# EAGLE schematic Control board FINAL (EAGLE 6.2)

## Sheet 1 of 4
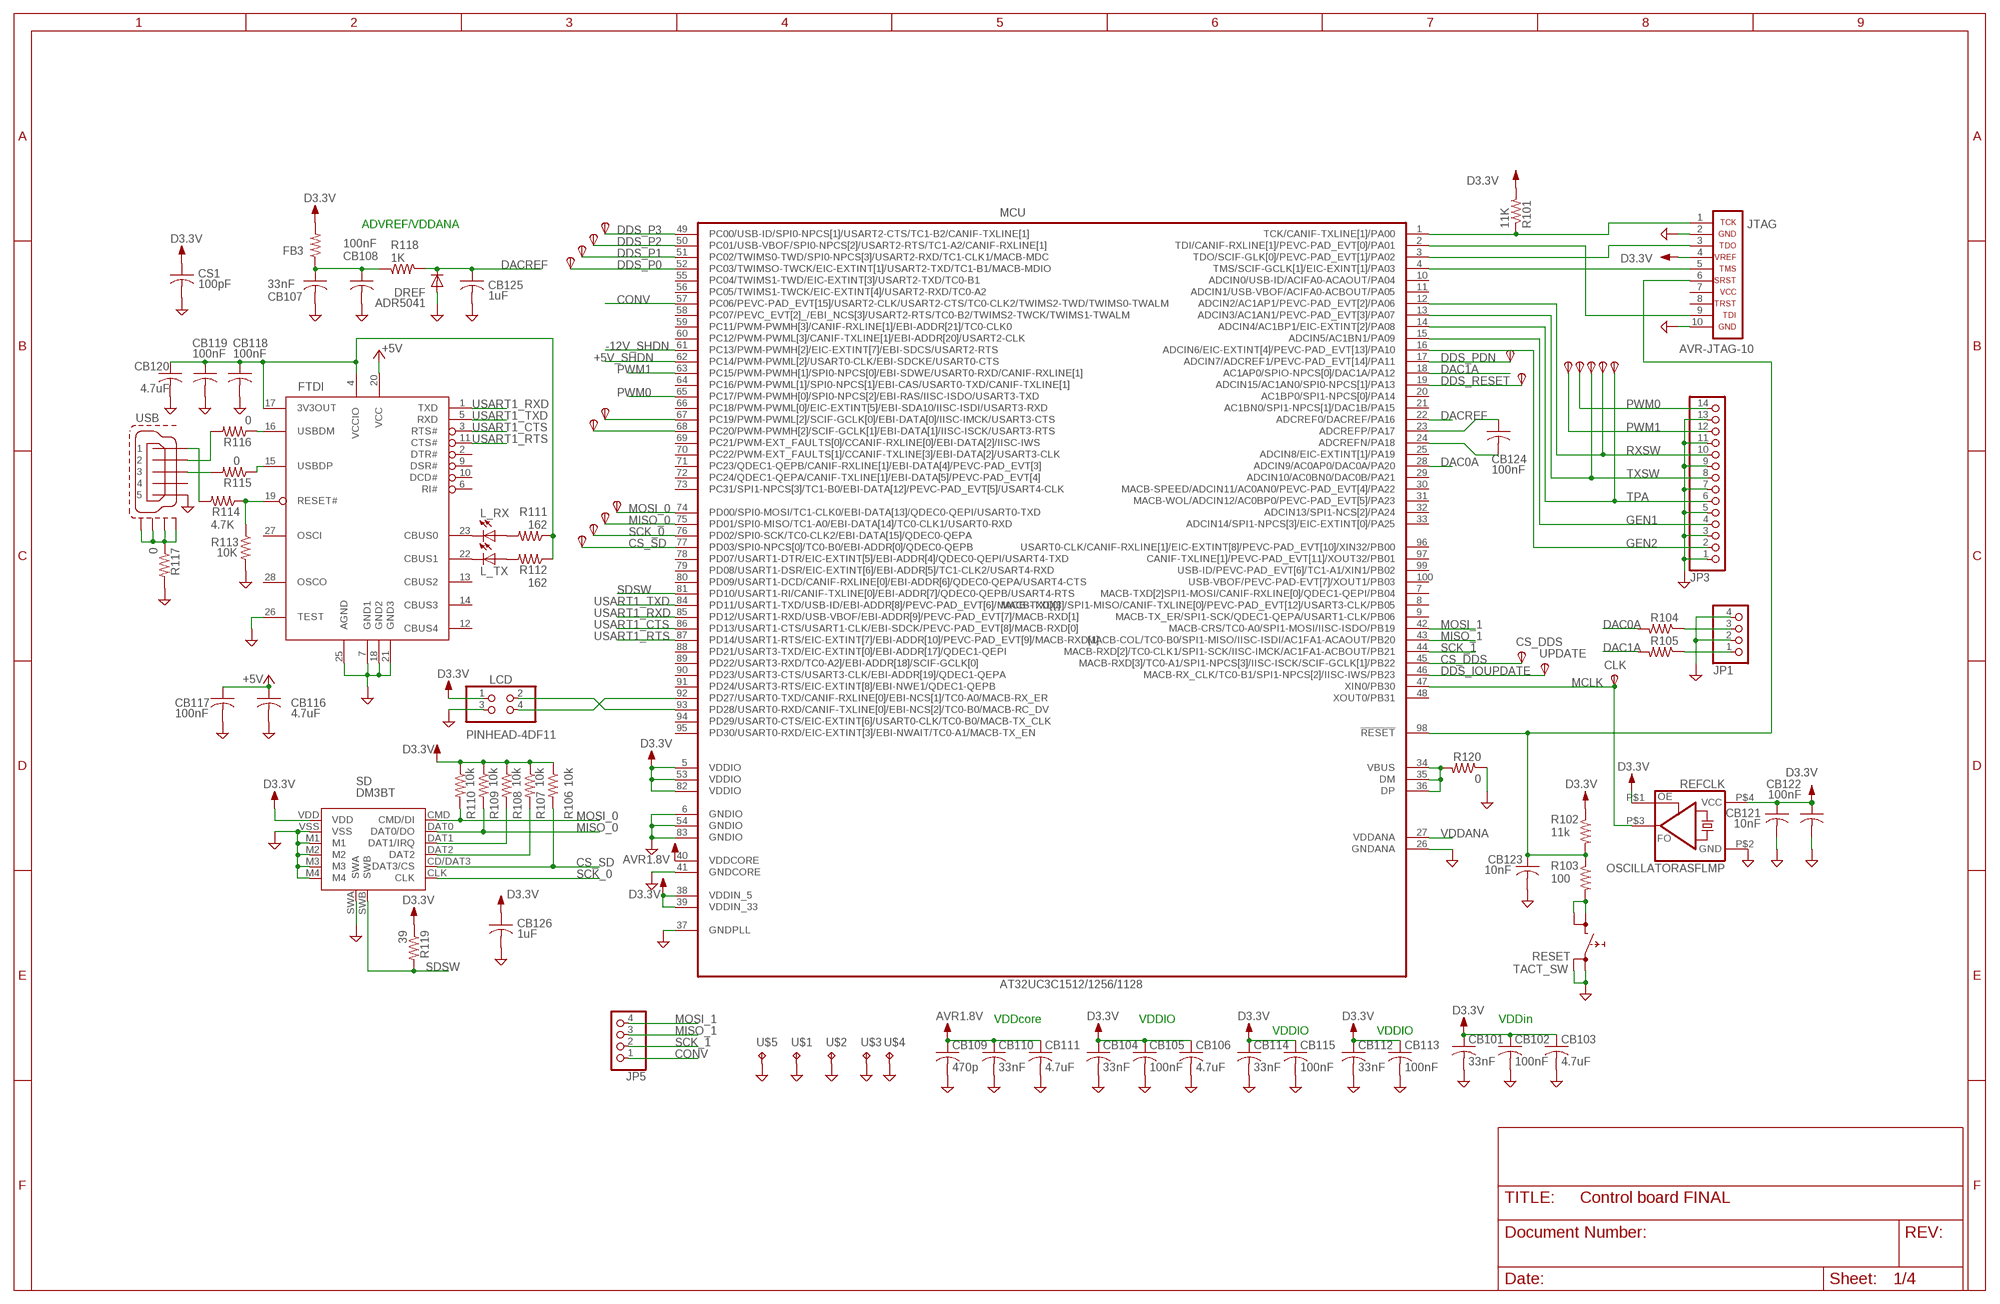
[diagram p0: schematic, sheet 1]

### Parts
CB101  33nF  C-USC0603  [C0603]
CB102  100nF  C-USC0603  [C0603]
CB103  4.7uF  C-USC0805  [C0805]
CB104  33nF  C-USC0603  [C0603]
CB105  100nF  C-USC0603  [C0603]
CB106  4.7uF  C-USC0805  [C0805]
CB107  33nF  C-USC0603  [C0603]
CB108  100nF  C-USC0603  [C0603]
CB109  470p  C-USC0603  [C0603]
CB110  33nF  C-USC0603  [C0603]
CB111  4.7uF  C-USC0805  [C0805]
CB112  33nF  C-USC0603  [C0603]
CB113  100nF  C-USC0603  [C0603]
CB114  33nF  C-USC0603  [C0603]
CB115  100nF  C-USC0603  [C0603]
CB116  4.7uF  C-USC0805  [C0805]
CB117  100nF  C-USC0603  [C0603]
CB118  100nF  C-USC0603  [C0603]
CB119  100nF  C-USC0603  [C0603]
CB120  4.7uF  C-USC0805  [C0805]
CB121  10nF  C-USC0603  [C0603]
CB122  100nF  C-USC0603  [C0603]
CB123  10nF  C-USC0603  [C0603]
CB124  100nF  C-USC0603  [C0603]
CB125  1uF  C-USC0603  [C0603]
CB126  1uF  C-USC0603  [C0603]
CLK  TPSTP10R  [TP10R]
CS1  100pF  C-USC0805  [C0805]
CS_DDS  TPSTP10R  [TP10R]
CS_SD  TPSTP10R  [TP10R]
DDSPDN  TPSTP10R  [TP10R]
DDSRESET  TPSTP10R  [TP10R]
DREF  ADR5041  REFERENCE-ADR50XXSOT23-3  [SOT23-3]
FB3  R-US_R0603  [R0603]
FTDI  FT232RL  [SSOP28DB]
GCLK0  TPSTP10R  [TP10R]
GCLK1  TPSTP10R  [TP10R]
JP1  PINHD-1X4  [1X04]
JP3  PINHD-1X14  [1X14]
JP5  PINHD-1X4  [1X04]
JTAG  AVR-JTAG-10  [AVR-JTAG-10]
L_RX  LEDCHIPLED_0805  [CHIPLED_0805]
L_TX  LEDCHIPLED_0805  [CHIPLED_0805]
LCD  PINHEAD-4DF11  [DF11-4POS]
MCU  AT32UC3C1512/1256/1128  [TQFP100]
MISO0  TPSTP10R  [TP10R]
MOSI0  TPSTP10R  [TP10R]
P0  TPSTP10R  [TP10R]
P1  TPSTP10R  [TP10R]
P2  TPSTP10R  [TP10R]
P3  TPSTP10R  [TP10R]
R101  11K  R-US_R0805  [R0805]
R102  11k  R-US_R0805  [R0805]
R103  100  R-US_R0805  [R0805]
R104  R-US_R0805  [R0805]
R105  R-US_R0805  [R0805]
R106  10k  R-US_R0805  [R0805]
R107  10k  R-US_R0805  [R0805]
R108  10k  R-US_R0805  [R0805]
R109  10k  R-US_R0805  [R0805]
R110  10k  R-US_R0805  [R0805]
R111  162  R-US_R0805  [R0805]
R112  162  R-US_R0805  [R0805]
R113  10K  R-US_R0805  [R0805]
R114  4.7K  R-US_R0805  [R0805]
R115  0  R-US_R0805  [R0805]
R116  0  R-US_R0805  [R0805]
R117  0  R-US_R0805  [R0805]
R118  1K  R-US_R0805  [R0805]
R119  39  R-US_R0805  [R0805]
R120  0  R-US_R0805  [R0805]
REFCLK  OSCILLATORASFLMP  [QFN4_ASFLMP_OSCILLATOR]
RESET  TACT_SW  [KMR2_TACT_SWITCH]
SCK0  TPSTP10R  [TP10R]
SD  DM3BT  [DM3BT]
TP1  TPSTP10R  [TP10R]
TP2  TPSTP10R  [TP10R]
TP3  TPSTP10R  [TP10R]
TP4  TPSTP10R  [TP10R]
TP5  TPSTP10R  [TP10R]
U$1  TESTPOINTKEYSTONE_ELECTRONICS_5016  [SMD_TESTPAD]
U$2  TESTPOINTKEYSTONE_ELECTRONICS_5016  [SMD_TESTPAD]
U$3  TESTPOINTKEYSTONE_ELECTRONICS_5016  [SMD_TESTPAD]
U$4  TESTPOINTKEYSTONE_ELECTRONICS_5016  [SMD_TESTPAD]
U$5  TESTPOINTKEYSTONE_ELECTRONICS_5016  [SMD_TESTPAD]
UPDATE  TPSTP10R  [TP10R]
USB  MINI-USB-SHIELD-UX60A-MB-5ST  [UX60A-MB-5ST]

### Nets
+5V: CB116.1 CB117.1 FTDI.20(VCC) ; also sheet 2,4
+5V_SHDN: MCU.62(PC14/PWM-PWML[2]/USART0-CLK/EBI-SDCKE/USART0-CTS) ; also sheet 4
-12V_SHDN: MCU.61(PC13/PWM-PWMH[2]/EIC-EXTINT[7]/EBI-SDCS/USART2-RTS) ; also sheet 4
AVR1.8V: CB109.1 CB110.1 CB111.1 MCU.40(VDDCORE)
CONV: JP5.1 MCU.57(PC06/PEVC-PAD_EVT[15]/USART2-CLK/USART2-CTS/TC0-CLK2/TWIMS2-TWD/TWIMS0-TWALM) ; also sheet 3
CS_DDS [Lowspeed digital]: CS_DDS.TP(PP) MCU.45(MACB-RXD[3]/TC0-A1/SPI1-NPCS[3]/IISC-ISCK/SCIF-GCLK[1]/PB22) ; also sheet 2
CS_SD: CS_SD.TP(PP) MCU.77(PD03/SPI0-NPCS[0]/TC0-B0/EBI-ADDR[0]/QDEC0-QEPB) R106.2 SD.CD/DAT3(DAT3/CS)
D3.3V: CB101.1 CB102.1 CB103.1 CB104.1 CB105.1 CB106.1 CB112.1 CB113.1 CB114.1 CB115.1 CB121.1 CB122.1 CB126.1 CS1.1 FB3.2 JTAG.4 LCD.1 MCU.5(VDDIO) MCU.38(VDDIN_5) MCU.39(VDDIN_33) MCU.53(VDDIO) MCU.82(VDDIO) R101.2 R102.1 R106.1 R107.1 R108.1 R109.1 R110.1 R119.1 REFCLK.P$1(OE) REFCLK.P$4(VCC) SD.VDD ; also sheet 2,4
DAC0A: MCU.28(ADCIN9/AC0AP0/DAC0A/PA20) R104.2
DAC1A: MCU.18(AC1AP0/SPIO-NPCS[0]/DAC1A/PA12) R105.2
DACREF: CB125.1 DREF.1(C) MCU.22(ADCREF0/DACREF/PA16) R118.2
DDS_IOUPDATE: MCU.46(MACB-RX_CLK/TC0-B1/SPI1-NPCS[2]/IISC-IWS/PB23) UPDATE.TP(PP) ; also sheet 2
DDS_P0: MCU.52(PC03/TWIMSO-TWCK/EIC-EXTINT[1]/USART2-TXD/TC1-B1/MACB-MDIO) P0.TP(PP) ; also sheet 2
DDS_P1: MCU.51(PC02/TWIMS0-TWD/SPI0-NPCS[3]/USART2-RXD/TC1-CLK1/MACB-MDC) P1.TP(PP) ; also sheet 2
DDS_P2 [Lowspeed digital]: MCU.50(PC01/USB-VBOF/SPI0-NPCS[2]/USART2-RTS/TC1-A2/CANIF-RXLINE[1]) P2.TP(PP) ; also sheet 2
DDS_P3 [Lowspeed digital]: MCU.49(PC00/USB-ID/SPI0-NPCS[1]/USART2-CTS/TC1-B2/CANIF-TXLINE[1]) P3.TP(PP) ; also sheet 2
DDS_PDN: DDSPDN.TP(PP) MCU.17(ADCIN7/ADCREF1/PEVC-PAD_EVT[14]/PA11) ; also sheet 2
DDS_RESET: DDSRESET.TP(PP) MCU.19(ADCIN15/AC1AN0/SPI0-NPCS[1]/PA13) ; also sheet 2
DGND: USB.5
GEN1: JP3.4 MCU.15(ADCIN5/AC1BN1/PA09)
GEN2: JP3.2 MCU.16(ADCIN6/EIC-EXTINT[4]/PEVC-PAD_EVT[13]/PA10)
GND: CB101.2 CB102.2 CB103.2 CB104.2 CB105.2 CB106.2 CB107.2 CB108.2 CB109.2 CB110.2 CB111.2 CB112.2 CB113.2 CB114.2 CB115.2 CB116.2 CB117.2 CB118.2 CB119.2 CB120.2 CB121.2 CB122.2 CB123.2 CB125.2 CB126.2 CS1.2 DREF.2(A) FTDI.7(GND1) FTDI.18(GND2) FTDI.21(GND3) FTDI.25(AGND) FTDI.26(TEST) JP1.2 JP1.4 JP3.1 JP3.3 JP3.5 JP3.7 JP3.9 JP3.11 JP3.13 JTAG.2 JTAG.10 LCD.3 MCU.6(GNDIO) MCU.26(GNDANA) MCU.37(GNDPLL) MCU.41(GNDCORE) MCU.54(GNDIO) MCU.83(GNDIO) R113.2 R117.2 R120.1 REFCLK.P$2(GND) RESET.P$1 RESET.P$3 SD.M1 SD.M2 SD.M3 SD.M4 SD.SWA SD.VSS U$1.P$1(TP) U$2.P$1(TP) U$3.P$1(TP) U$4.P$1(TP) U$5.P$1(TP) ; also sheet 2,3,4
MCLK: CLK.TP(PP) MCU.47(XIN0/PB30) REFCLK.P$3(FO) ; also sheet 2
MISO_0: MCU.75(PD01/SPI0-MISO/TC1-A0/EBI-DATA[14]/TC0-CLK1/USART0-RXD) MISO0.TP(PP) R109.2 SD.DAT0(DAT0/DO)
MISO_1: JP5.3 MCU.43(MACB-COL/TC0-B0/SPI1-MISO/IISC-ISDI/AC1FA1-ACAOUT/PB20) ; also sheet 2,3
MOSI_0: MCU.74(PD00/SPI0-MOSI/TC1-CLK0/EBI-DATA[13]/QDEC0-QEPI/USART0-TXD) MOSI0.TP(PP) R110.2 SD.CMD(CMD/DI)
MOSI_1: JP5.4 MCU.42(MACB-CRS/TC0-A0/SPI1-MOSI/IISC-ISDO/PB19) ; also sheet 2
N$17: CB123.1 JTAG.6 MCU.98(!RESET) R102.2 R103.1
N$18: JTAG.1 MCU.1(TCK/CANIF-TXLINE[1]/PA00) R101.1
N$19: JTAG.9 MCU.2(TDI/CANIF-RXLINE[1]/PEVC-PAD_EVT[0]/PA01)
N$20: JTAG.3 MCU.3(TDO/SCIF-GLK[0]/PEVC-PAD_EVT[1]/PA02)
N$21: JTAG.5 MCU.4(TMS/SCIF-GCLK[1]/EIC-EXINT[1]/PA03)
N$22: JP1.3 R104.1
N$24: CB118.1 CB119.1 CB120.1 FTDI.4(VCCIO) FTDI.17(3V3OUT) R111.1 R112.1
N$30: R115.2 USB.3
N$31: R116.2 USB.2
N$33: FTDI.15(USBDP) R115.1
N$34: FTDI.16(USBDM) R116.1
N$35: FTDI.19(RESET#) R113.1 R114.1
N$36: R114.2 USB.1
N$37: CB124.2 MCU.24(ADCREFN/PA18)
N$45: R103.2 RESET.P$2 RESET.P$4
N$46: R108.2 SD.DAT1(DAT1/IRQ)
N$47: R107.2 SD.DAT2
N$48: CB124.1 MCU.23(ADCREFP/PA17)
N$49: JP1.1 R105.1
N$51: R117.1 USB.M1(S1) USB.M2(S2) USB.M3(S3) USB.M4(S4)
N$56: MCU.34(VBUS) MCU.35(DM) MCU.36(DP) R120.2
N$83: FTDI.23(CBUS0) L_RX.C
N$86: L_RX.A R111.2
N$87: L_TX.A R112.2
N$89: FTDI.22(CBUS1) L_TX.C
N$95: GCLK0.TP(PP) MCU.67(PC19/PWM-PWML[2]/SCIF-GCLK[0]/EBI-DATA[0]/IISC-IMCK/USART3-CTS)
N$97: GCLK1.TP(PP) MCU.68(PC20/PWM-PWMH[2]/SCIF-GCLK[1]/EBI-DATA[1]/IISC-ISCK/USART3-RTS)
PWM0: JP3.14 MCU.65(PC17/PWM-PWMH[0]/SPI0-NPCS[2]/EBI-RAS/IISC-ISDO/USART3-TXD) TP2.TP(PP)
PWM1: JP3.12 MCU.63(PC15/PWM-PWMH[1]/SPI0-NPCS[0]/EBI-SDWE/USART0-RXD/CANIF-RXLINE[1]) TP1.TP(PP)
RXSW: JP3.10 MCU.12(ADCIN2/AC1AP1/PEVC-PAD_EVT[2]/PA06) TP4.TP(PP)
SCK_0: MCU.76(PD02/SPI0-SCK/TC0-CLK2/EBI-DATA[15]/QDEC0-QEPA) SCK0.TP(PP) SD.CLK
SCK_1: JP5.2 MCU.44(MACB-RXD[2]/TC0-CLK1/SPI1-SCK/IISC-IMCK/AC1FA1-ACBOUT/PB21) ; also sheet 2,3
SDSW: MCU.81(PD10/USART1-RI/CANIF-TXLINE[0]/EBI-ADDR[7]/QDEC0-QEPB/USART4-RTS) R119.2 SD.SWB
TPA: JP3.6 MCU.14(ADCIN4/AC1BP1/EIC-EXTINT[2]/PA08) TP5.TP(PP)
TXSW: JP3.8 MCU.13(ADCIN3/AC1AN1/PEVC-PAD_EVT[3]/PA07) TP3.TP(PP)
USART0_RXD: LCD.2 MCU.93(PD28/USART0-RXD/CANIF-TXLINE[0]/EBI-NCS[2]/TC0-B0/MACB-RC_DV)
USART0_TXD: LCD.4 MCU.92(PD27/USART0-TXD/CANIF-RXLINE[0]/EBI-NCS[1]/TC0-A0/MACB-RX_ER)
USART1_CTS: FTDI.3(RTS#) MCU.86(PD13/USART1-CTS/USART1-CLK/EBI-SDCK/PEVC-PAD_EVT[8]/MACB-RXD[0])
USART1_RTS: FTDI.11(CTS#) MCU.87(PD14/USART1-RTS/EIC-EXTINT[7]/EBI-ADDR[10]/PEVC-PAD_EVT[9]/MACB-RXD[1])
USART1_RXD: FTDI.1(TXD) MCU.85(PD12/USART1-RXD/USB-VBOF/EBI-ADDR[9]/PEVC-PAD_EVT[7]/MACB-RXD[1])
USART1_TXD: FTDI.5(RXD) MCU.84(PD11/USART1-TXD/USB-ID/EBI-ADDR[8]/PEVC-PAD_EVT[6]/MACB-TXD[0])
VDDANA: CB107.1 CB108.1 FB3.1 MCU.27(VDDANA) R118.1
Unconnected: FTDI.2(DTR#) FTDI.6(RI#) FTDI.9(DSR#) FTDI.10(DCD#) FTDI.12(CBUS4) FTDI.13(CBUS2) FTDI.14(CBUS3) FTDI.27(OSCI) FTDI.28(OSCO) JTAG.7 JTAG.8 MCU.7(MACB-TXD[2]SPI1-MOSI/CANIF-RXLINE[0]/QDEC1-QEPI/PB04) MCU.8(MACB-TXD[3]/SPI1-MISO/CANIF-TXLINE[0]/PEVC-PAD_EVT[12]/USART3-CLK/PB05) MCU.9(MACB-TX_ER/SPI1-SCK/QDEC1-QEPA/USART1-CLK/PB06) MCU.10(ADCIN0/USB-ID/ACIFA0-ACAOUT/PA04) MCU.11(ADCIN1/USB-VBOF/ACIFA0-ACBOUT/PA05) MCU.20(AC1BP0/SPI1-NPCS[0]/PA14) MCU.21(AC1BN0/SPI1-NPCS[1]/DAC1B/PA15) MCU.25(ADCIN8/EIC-EXTINT[1]/PA19) MCU.29(ADCIN10/AC0BN0/DAC0B/PA21) MCU.30(MACB-SPEED/ADCIN11/AC0AN0/PEVC-PAD_EVT[4]/PA22) MCU.31(MACB-WOL/ADCIN12/AC0BP0/PEVC-PAD_EVT[5]/PA23) MCU.32(ADCIN13/SPI1-NCS[2]/PA24) MCU.33(ADCIN14/SPI1-NPCS[3]/EIC-EXTINT[0]/PA25) MCU.48(XOUT0/PB31) MCU.55(PC04/TWIMS1-TWD/EIC-EXTINT[3]/USART2-TXD/TC0-B1) MCU.56(PC05/TWIMS1-TWCK/EIC-EXTINT[4]/USART2-RXD/TC0-A2) MCU.58(PC07/PEVC_EVT[2]_/EBI_NCS[3]/USART2-RTS/TC0-B2/TWIMS2-TWCK/TWIMS1-TWALM) MCU.59(PC11/PWM-PWMH[3]/CANIF-RXLINE[1]/EBI-ADDR[21]/TC0-CLK0) MCU.60(PC12/PWM-PWML[3]/CANIF-TXLINE[1]/EBI-ADDR[20]/USART2-CLK) MCU.64(PC16/PWM-PWML[1]/SPI0-NPCS[1]/EBI-CAS/USART0-TXD/CANIF-TXLINE[1]) MCU.66(PC18/PWM-PWML[0]/EIC-EXTINT[5]/EBI-SDA10/IISC-ISDI/USART3-RXD) MCU.69(PC21/PWM-EXT_FAULTS[0]/CCANIF-RXLINE[0]/EBI-DATA[2]/IISC-IWS) MCU.70(PC22/PWM-EXT_FAULTS[1]/CCANIF-TXLINE[3]/EBI-DATA[2]/USART3-CLK) MCU.71(PC23/QDEC1-QEPB/CANIF-RXLINE[1]/EBI-DATA[4]/PEVC-PAD_EVT[3]) MCU.72(PC24/QDEC1-QEPA/CANIF-TXLINE[1]/EBI-DATA[5]/PEVC-PAD_EVT[4]) MCU.73(PC31/SPI1-NPCS[3]/TC1-B0/EBI-DATA[12]/PEVC-PAD_EVT[5]/USART4-CLK) MCU.78(PD07/USART1-DTR/EIC-EXTINT[5]/EBI-ADDR[4]/QDEC0-QEPI/USART4-TXD) MCU.79(PD08/USART1-DSR/EIC-EXTINT[6]/EBI-ADDR[5]/TC1-CLK2/USART4-RXD) MCU.80(PD09/USART1-DCD/CANIF-RXLINE[0]/EBI-ADDR[6]/QDEC0-QEPA/USART4-CTS) MCU.88(PD21/USART3-TXD/EIC-EXTINT[0]/EBI-ADDR[17]/QDEC1-QEPI) MCU.89(PD22/USART3-RXD/TC0-A2]/EBI-ADDR[18]/SCIF-GCLK[0]) MCU.90(PD23/USART3-CTS/USART3-CLK/EBI-ADDR[19]/QDEC1-QEPA) MCU.91(PD24/USART3-RTS/EIC-EXTINT[8]/EBI-NWE1/QDEC1-QEPB) MCU.94(PD29/USART0-CTS/EIC-EXTINT[6]/USART0-CLK/TC0-B0/MACB-TX_CLK) MCU.95(PD30/USART0-RXD/EIC-EXTINT[3]/EBI-NWAIT/TC0-A1/MACB-TX_EN) MCU.96(USART0-CLK/CANIF-RXLINE[1]/EIC-EXTINT[8]/PEVC-PAD_EVT[10]/XIN32/PB00) MCU.97(CANIF-TXLINE[1]/PEVC-PAD_EVT[11]/XOUT32/PB01) MCU.99(USB-ID/PEVC-PAD_EVT[6]/TC1-A1/XIN1/PB02) MCU.100(USB-VBOF/PEVC-PAD-EVT[7]/XOUT1/PB03) USB.4

### Notes on the sheet
- ADVREF/VDDANA
- VDDcore | VDDIO | VDDin
- VDDIO | VDDIO

## Sheet 2 of 4
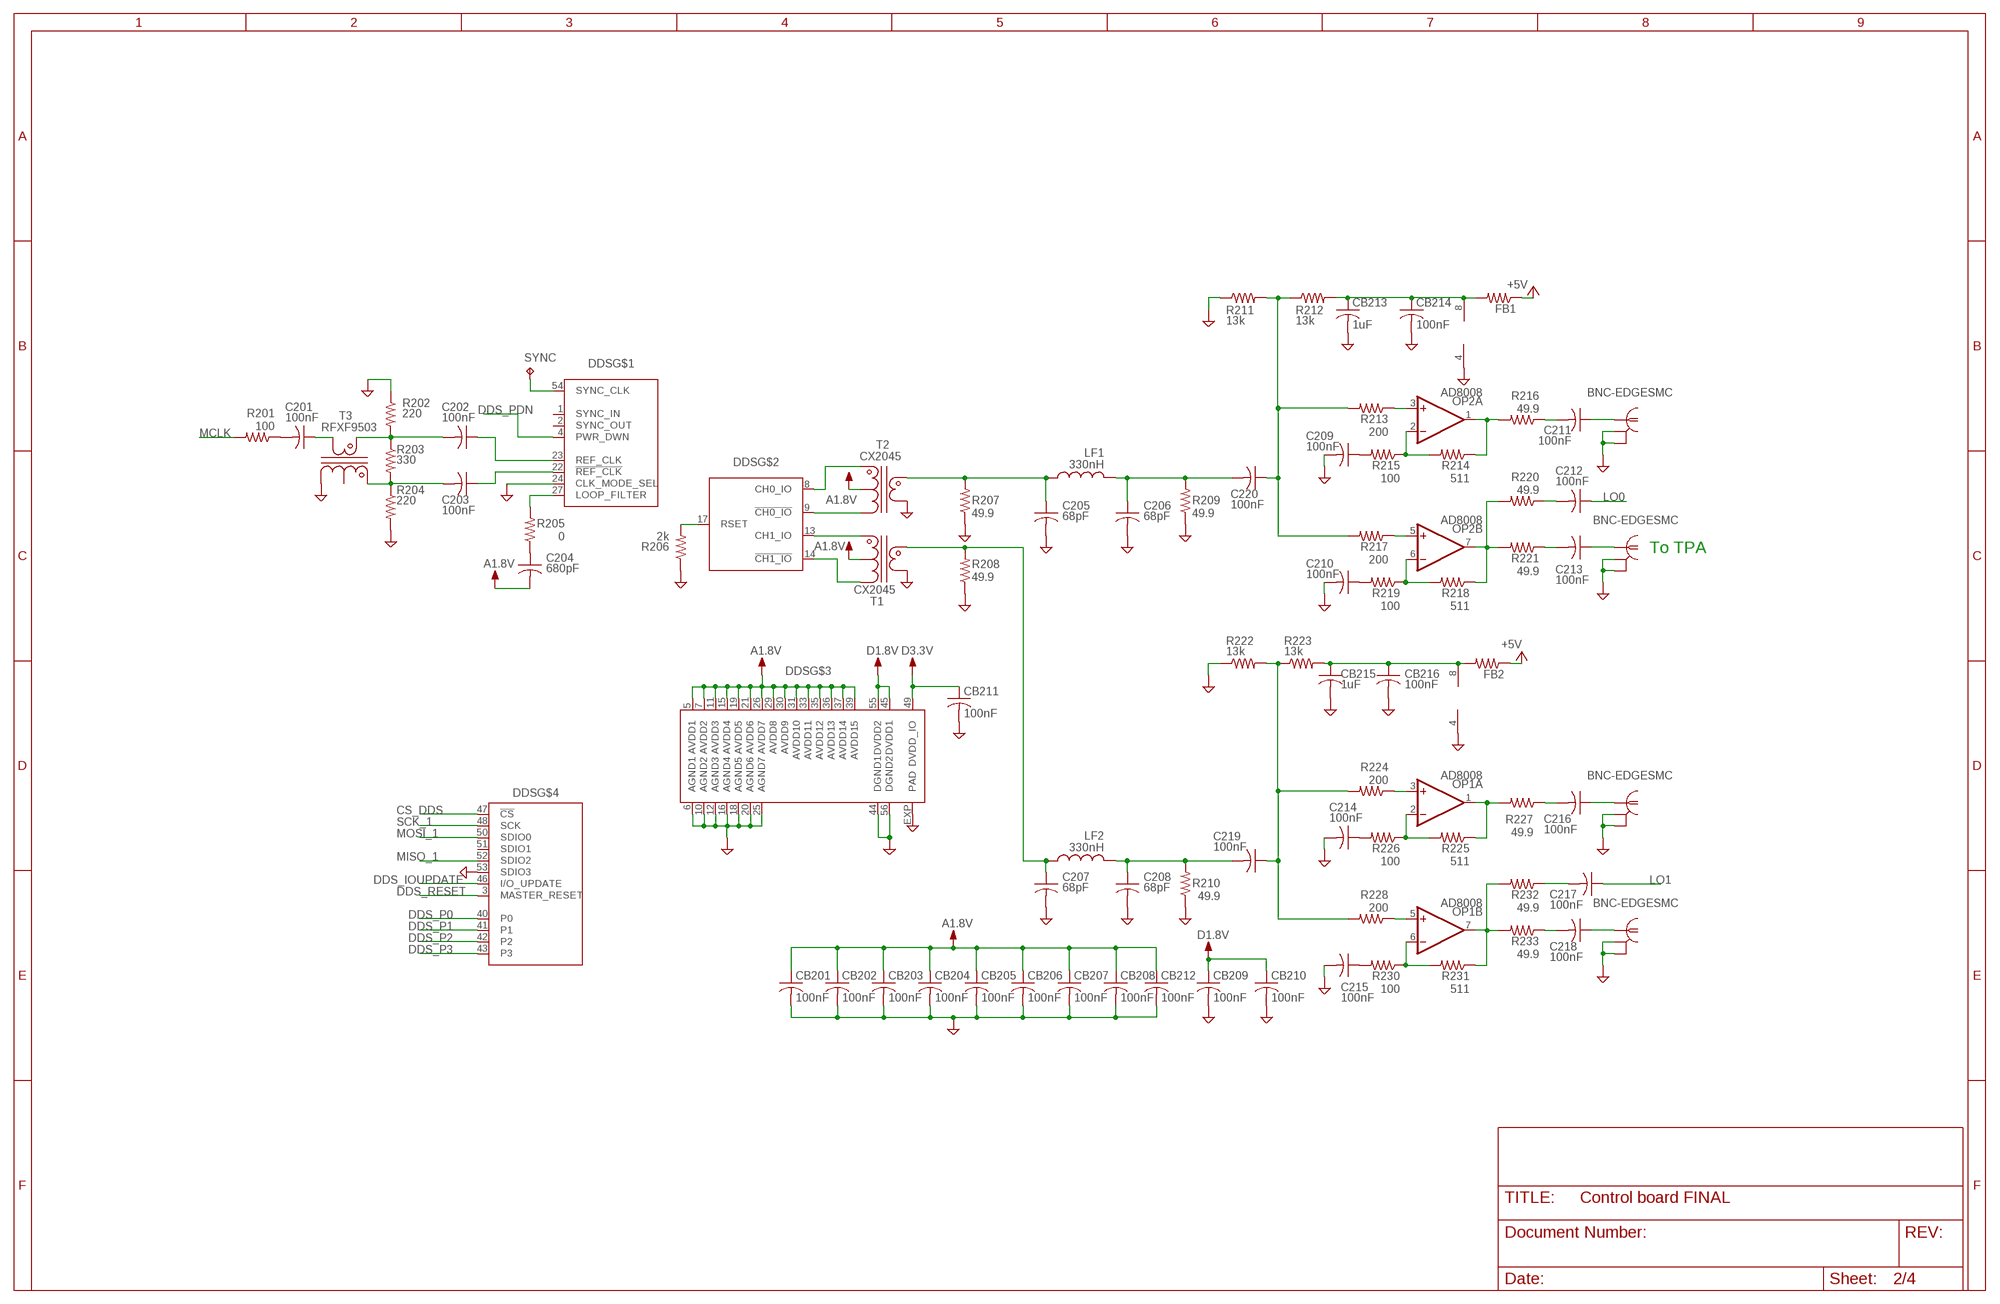
[diagram p1: schematic, sheet 2]

### Parts
C201  100nF  C-USC0603  [C0603]
C202  100nF  C-USC0603  [C0603]
C203  100nF  C-USC0603  [C0603]
C204  680pF  C-USC0805  [C0805]
C205  68pF  CAPACITOR1008  [1008]
C206  68pF  CAPACITOR1008  [1008]
C207  68pF  CAPACITOR1008  [1008]
C208  68pF  CAPACITOR1008  [1008]
C209  100nF  C-USC0603  [C0603]
C210  100nF  C-USC0603  [C0603]
C211  100nF  C-USC0603  [C0603]
C212  100nF  C-USC0603  [C0603]
C213  100nF  C-USC0603  [C0603]
C214  100nF  C-USC0603  [C0603]
C215  100nF  C-USC0603  [C0603]
C216  100nF  C-USC0603  [C0603]
C217  100nF  C-USC0603  [C0603]
C218  100nF  C-USC0603  [C0603]
C219  100nF  C-USC0603  [C0603]
C220  100nF  C-USC0603  [C0603]
CB201  100nF  C-USC0603  [C0603]
CB202  100nF  C-USC0603  [C0603]
CB203  100nF  C-USC0603  [C0603]
CB204  100nF  C-USC0603  [C0603]
CB205  100nF  C-USC0603  [C0603]
CB206  100nF  C-USC0603  [C0603]
CB207  100nF  C-USC0603  [C0603]
CB208  100nF  C-USC0603  [C0603]
CB209  100nF  C-USC0603  [C0603]
CB210  100nF  C-USC0603  [C0603]
CB211  100nF  C-USC0603  [C0603]
CB212  100nF  C-USC0603  [C0603]
CB213  1uF  C-USC0805  [C0805]
CB214  100nF  C-USC0603  [C0603]
CB215  1uF  C-USC0805  [C0805]
CB216  100nF  C-USC0603  [C0603]
DDS  AD9958  [LFCSP-56]
FB1  R-US_R0603  [R0603]
FB2  R-US_R0603  [R0603]
LF1  330nH  INDUCTOR1008  [1008]
LF2  330nH  INDUCTOR1008  [1008]
LO0  BNC-EDGESMC  [SMC-EDGE]
LO1  BNC-EDGESMC  [SMC-EDGE]
OP1  AD8008  2AMP_P8+4D  [SO08]
OP2  AD8008  2AMP_P8+4D  [SO08]
R201  100  R-US_R0805  [R0805]
R202  220  R-US_R0805  [R0805]
R203  330  R-US_R0805  [R0805]
R204  220  R-US_R0805  [R0805]
R205  0  R-US_R0805  [R0805]
R206  2k  R-US_R0805  [R0805]
R207  49.9  R-US_R0805  [R0805]
R208  49.9  R-US_R0805  [R0805]
R209  49.9  R-US_R0805  [R0805]
R210  49.9  R-US_R0805  [R0805]
R211  13k  R-US_R0805  [R0805]
R212  13k  R-US_R0805  [R0805]
R213  200  R-US_R0805  [R0805]
R214  511  R-US_R0805  [R0805]
R215  100  R-US_R0805  [R0805]
R216  49.9  R-US_R0805  [R0805]
R217  200  R-US_R0805  [R0805]
R218  511  R-US_R0805  [R0805]
R219  100  R-US_R0805  [R0805]
R220  49.9  R-US_R0805  [R0805]
R221  49.9  R-US_R0805  [R0805]
R222  13k  R-US_R0805  [R0805]
R223  13k  R-US_R0805  [R0805]
R224  200  R-US_R0805  [R0805]
R225  511  R-US_R0805  [R0805]
R226  100  R-US_R0805  [R0805]
R227  49.9  R-US_R0805  [R0805]
R228  200  R-US_R0805  [R0805]
R230  100  R-US_R0805  [R0805]
R231  511  R-US_R0805  [R0805]
R232  49.9  R-US_R0805  [R0805]
R233  49.9  R-US_R0805  [R0805]
SYNC  TPTP10R  [TP10R]
T1  CX2045  BALUN_2:1  [CX20XX_BALUN]
T2  CX2045  BALUN_2:1  [CX20XX_BALUN]
T3  RFXF9503  BALUN_2:1  [CX20XX_BALUN]
TX0  BNC-EDGESMC  [SMC-EDGE]
TX1  BNC-EDGESMC  [SMC-EDGE]

### Nets
+5V: FB1.1 FB2.1 ; also sheet 1,4
A1.8V: C204.2 CB201.1 CB202.1 CB203.1 CB204.1 CB205.1 CB206.1 CB207.1 CB208.1 CB212.1 DDS.5(AVDD1) DDS.7(AVDD2) DDS.11(AVDD3) DDS.15(AVDD4) DDS.19(AVDD5) DDS.21(AVDD6) DDS.26(AVDD7) DDS.29(AVDD8) DDS.30(AVDD9) DDS.31(AVDD10) DDS.33(AVDD11) DDS.35(AVDD12) DDS.36(AVDD13) DDS.37(AVDD14) DDS.39(AVDD15) T1.P$2 T2.P$2 ; also sheet 4
A12V1: CB213.1 CB214.1 FB1.2 OP2.8(P:V+) R212.2
A12V2: CB215.1 CB216.1 FB2.2 OP1.8(P:V+) R223.2
C201: C201.2 R201.1
CS_DDS [Lowspeed digital]: DDS.47(!CS) ; also sheet 1
D1.8V: CB209.1 CB210.1 DDS.45(DVDD1) DDS.55(DVDD2) ; also sheet 4
D3.3V: CB211.1 DDS.49(DVDD_IO) ; also sheet 1,4
DDS_IOUPDATE: DDS.46(I/O_UPDATE) ; also sheet 1
DDS_P0: DDS.40(P0) ; also sheet 1
DDS_P1: DDS.41(P1) ; also sheet 1
DDS_P2 [Lowspeed digital]: DDS.42(P2) ; also sheet 1
DDS_P3 [Lowspeed digital]: DDS.43(P3) ; also sheet 1
DDS_PDN: DDS.4(PWR_DWN) ; also sheet 1
DDS_RESET: DDS.3(MASTER_RESET) ; also sheet 1
GND: C205.P$2 C206.P$2 C207.P$2 C208.P$2 C209.2 C210.2 C214.2 C215.2 CB201.2 CB202.2 CB203.2 CB204.2 CB205.2 CB206.2 CB207.2 CB208.2 CB209.2 CB210.2 CB211.2 CB212.2 CB213.2 CB214.2 CB215.2 CB216.2 DDS.6(AGND1) DDS.10(AGND2) DDS.12(AGND3) DDS.16(AGND4) DDS.18(AGND5) DDS.20(AGND6) DDS.24(CLK_MODE_SEL) DDS.25(AGND7) DDS.44(DGND1) DDS.53(SDIO3) DDS.56(DGND2) DDS.EXP(PAD) LO0.2(GND1) LO0.3(GND2) LO1.2(GND1) LO1.3(GND2) OP1.4(P:V-) OP2.4(P:V-) R202.1 R204.2 R206.1 R207.1 R208.1 R209.1 R210.1 R211.1 R222.1 T1.P$4 T2.P$4 T3.P$3 TX0.2(GND1) TX0.3(GND2) TX1.2(GND1) TX1.3(GND2) ; also sheet 1,3,4
LO0: C212.1 ; also sheet 3
LO1: C217.1 ; also sheet 3
MCLK: R201.2 ; also sheet 1
MISO_1: DDS.52(SDIO2) ; also sheet 1,3
MOSI_1: DDS.50(SDIO0) ; also sheet 1
N$1: C212.2 R220.1
N$3: DDS.9(!CH0_IO) T2.P$3
N$4: DDS.8(CH0_IO) T2.P$1
N$5: DDS.14(!CH1_IO) T1.P$3
N$6: DDS.13(CH1_IO) T1.P$1
N$10: C202.1 DDS.23(REF_CLK)
N$11: C203.1 DDS.22(!REF_CLK)
N$12: C202.2 R202.2 R203.1 T3.P$5
N$13: C204.1 R205.1
N$14: DDS.27(LOOP_FILTER) R205.2
N$15: C203.2 R203.2 R204.1 T3.P$1
N$16: DDS.17(RSET) R206.2
N$26: C217.2 R232.1
N$27: DDS.54(SYNC_CLK) SYNC.TP
N$29: C207.P$1 LF2.P$1 R208.2 T1.P$5
N$32: C205.P$1 LF1.P$1 R207.2 T2.P$5
N$50: C206.P$1 C220.2 LF1.P$2 R209.2
N$52: C209.1 R215.2
N$53: OP2.2(A:-IN) R214.2 R215.1
N$54: OP2.1(A:OUT) R214.1 R216.2
N$55: OP2.3(A:+IN) R213.1
N$57: OP2.6(B:-IN) R218.2 R219.1
N$58: OP2.7(B:OUT) R218.1 R220.2 R221.2
N$59: OP2.5(B:+IN) R217.1
N$60: C210.1 R219.2
N$64: C208.P$1 C219.2 LF2.P$2 R210.2
N$65: C211.1 TX0.1
N$66: C214.1 R226.2
N$67: OP1.2(A:-IN) R225.2 R226.1
N$68: OP1.1(A:OUT) R225.1 R227.2
N$69: OP1.3(A:+IN) R224.1
N$70: OP1.6(B:-IN) R230.1 R231.2
N$71: OP1.7(B:OUT) R231.1 R232.2 R233.2
N$72: OP1.5(B:+IN) R228.1
N$73: C215.1 R230.2
N$74: C219.1 R222.2 R223.1 R224.2 R228.2
N$76: C211.2 R216.1
N$78: C213.1 LO0.1
N$79: C213.2 R221.1
N$81: C216.1 TX1.1
N$82: C216.2 R227.1
N$84: C218.1 LO1.1
N$85: C218.2 R233.1
N$124: C201.1 T3.P$4
R211: C220.1 R211.2 R212.1 R213.2 R217.2
SCK_1: DDS.48(SCK) ; also sheet 1,3
Unconnected: DDS.1(SYNC_IN) DDS.2(SYNC_OUT) DDS.51(SDIO1) T3.P$2

### Notes on the sheet
- To TPA

## Sheet 3 of 4
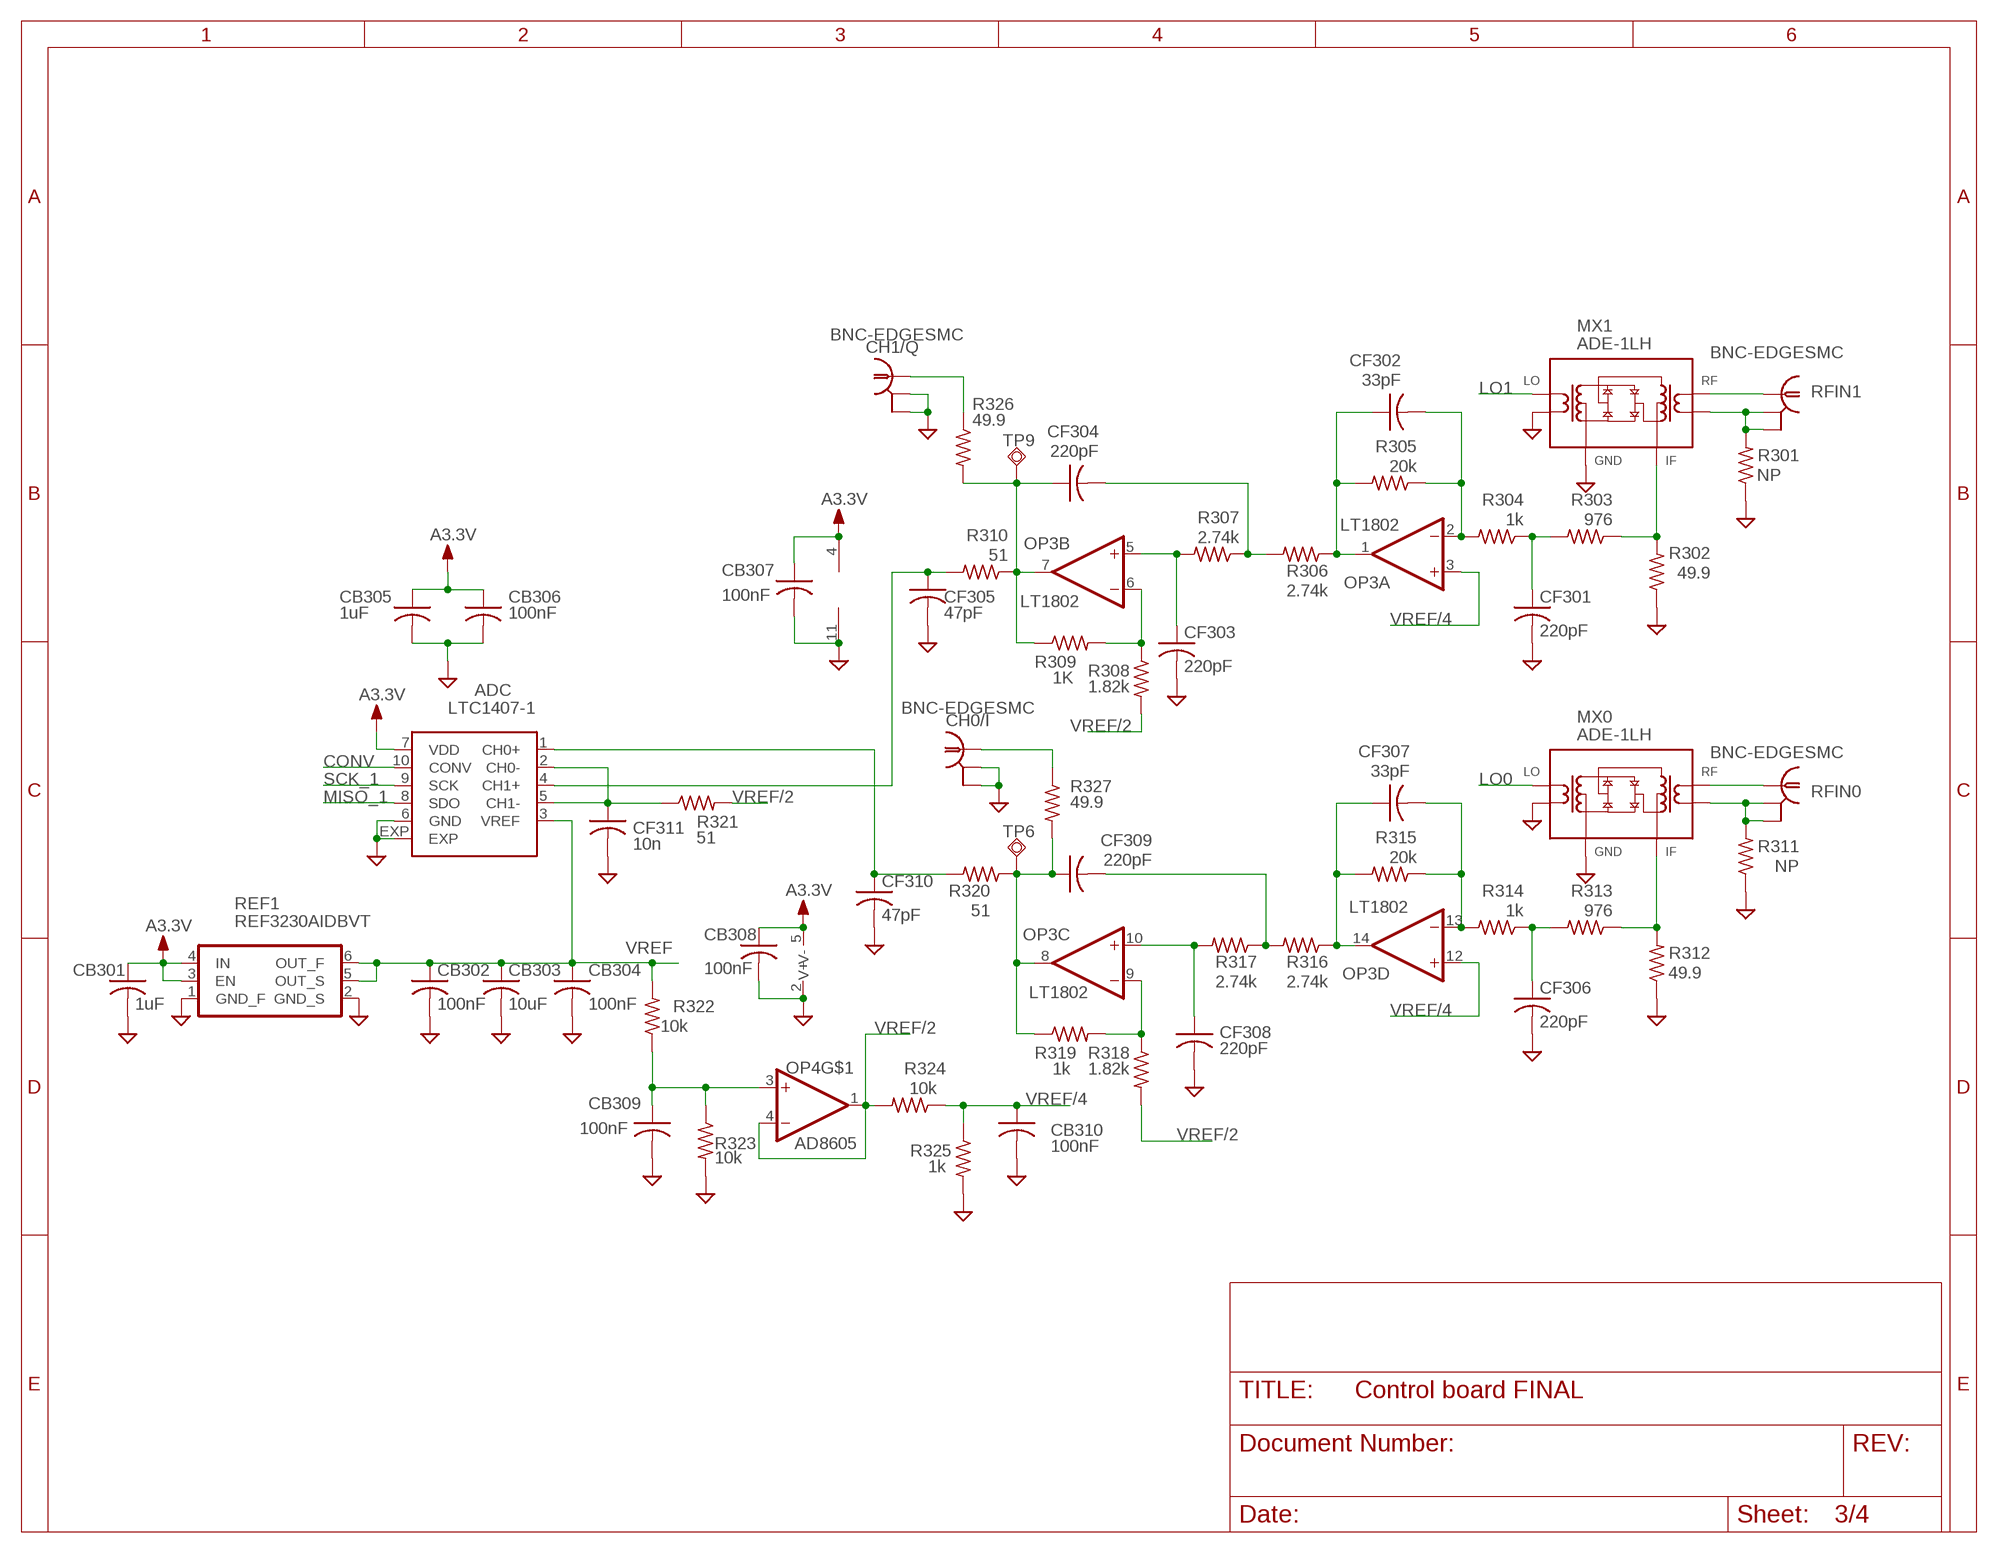
[diagram p2: schematic, sheet 3]

### Parts
ADC  LTC1407-1  [MSOP-10-EXP]
CB301  1uF  C-USC0603  [C0603]
CB302  100nF  C-USC0603  [C0603]
CB303  10uF  C-USC0805  [C0805]
CB304  100nF  C-USC0603  [C0603]
CB305  1uF  C-USC0603  [C0603]
CB306  100nF  C-USC0603  [C0603]
CB307  100nF  C-USC0603  [C0603]
CB308  100nF  C-USC0603  [C0603]
CB309  100nF  C-USC0603  [C0603]
CB310  100nF  C-USC0603  [C0603]
CF301  220pF  C-USC0805  [C0805]
CF302  33pF  C-USC0805  [C0805]
CF303  220pF  C-USC0805  [C0805]
CF304  220pF  C-USC0805  [C0805]
CF305  47pF  C-USC0603  [C0603]
CF306  220pF  C-USC0805  [C0805]
CF307  33pF  C-USC0805  [C0805]
CF308  220pF  C-USC0805  [C0805]
CF309  220pF  C-USC0805  [C0805]
CF310  47pF  C-USC0603  [C0603]
CF311  10n  C-USC0603  [C0603]
CH0/I  BNC-EDGESMC  [SMC-EDGE]
CH1/Q  BNC-EDGESMC  [SMC-EDGE]
MX0  ADE-1LH  [CD636]
MX1  ADE-1LH  [CD636]
OP3  LT1802  4AMP_P4+11D  [SO14]
OP4  AD8605  LMH6624  [SOT23-5]
R301  NP  R-US_R0805  [R0805]
R302  49.9  R-US_R0805  [R0805]
R303  976  R-US_R0805  [R0805]
R304  1k  R-US_R0805  [R0805]
R305  20k  R-US_R0805  [R0805]
R306  2.74k  R-US_R0805  [R0805]
R307  2.74k  R-US_R0805  [R0805]
R308  1.82k  R-US_R0805  [R0805]
R309  1K  R-US_R0805  [R0805]
R310  51  R-US_R0805  [R0805]
R311  NP  R-US_R0805  [R0805]
R312  49.9  R-US_R0805  [R0805]
R313  976  R-US_R0805  [R0805]
R314  1k  R-US_R0805  [R0805]
R315  20k  R-US_R0805  [R0805]
R316  2.74k  R-US_R0805  [R0805]
R317  2.74k  R-US_R0805  [R0805]
R318  1.82k  R-US_R0805  [R0805]
R319  1k  R-US_R0805  [R0805]
R320  51  R-US_R0805  [R0805]
R321  51  R-US_R0805  [R0805]
R322  10k  R-US_R0805  [R0805]
R323  10k  R-US_R0805  [R0805]
R324  10k  R-US_R0805  [R0805]
R325  1k  R-US_R0805  [R0805]
R326  49.9  R-US_R0805  [R0805]
R327  49.9  R-US_R0805  [R0805]
REF1  REF3230AIDBVT  REF32XX  [SOT23-6]
RFIN0  BNC-EDGESMC  [SMC-EDGE]
RFIN1  BNC-EDGESMC  [SMC-EDGE]
TP6  TPSQTP16R  [TP16R]
TP9  TPSQTP16R  [TP16R]

### Nets
A3.3V: ADC.7(VDD) CB301.1 CB305.1 CB306.1 CB307.1 CB308.1 OP3.4(P:V+) OP4.5(V+) REF1.3(EN) REF1.4(IN) ; also sheet 4
CONV: ADC.10(CONV) ; also sheet 1
GND: ADC.6(GND) ADC.EXP CB301.2 CB302.2 CB303.2 CB304.2 CB305.2 CB306.2 CB307.2 CB308.2 CB309.2 CB310.2 CF301.2 CF303.2 CF305.2 CF306.2 CF308.2 CF310.2 CF311.2 CH0/I.2(GND1) CH0/I.3(GND2) CH1/Q.2(GND1) CH1/Q.3(GND2) MX0.P$1(LON) MX0.P$5(GND) MX1.P$1(LON) MX1.P$5(GND) OP3.11(P:V-) OP4.2(V-) R301.1 R302.1 R311.1 R312.1 R323.2 R325.2 REF1.1(GND_F) REF1.2(GND_S) ; also sheet 1,2,4
LO0: MX0.P$6(LOP) ; also sheet 2
LO1: MX1.P$6(LOP) ; also sheet 2
MISO_1: ADC.8(SDO) ; also sheet 1,2
N$28: CH0/I.1 R327.1
N$38: CH1/Q.1 R326.1
N$96: CF307.2 OP3.13(D:-IN) R314.2 R315.1
N$98: CF309.2 R316.2 R317.1
N$99: CF308.1 OP3.10(C:+IN) R317.2
N$100: OP3.9(C:-IN) R318.1 R319.2
N$101: ADC.4(CH1+) CF305.1 R310.2
N$102: CF307.1 OP3.14(D:OUT) R315.2 R316.1
N$103: CF306.1 R313.2 R314.1
N$104: MX0.P$2(IF) R312.2 R313.1
N$105: CF302.2 OP3.2(A:-IN) R304.2 R305.1
N$106: CF304.2 R306.2 R307.1
N$107: CF303.1 OP3.5(B:+IN) R307.2
N$108: OP3.6(B:-IN) R308.1 R309.2
N$109: CF304.1 OP3.7(B:OUT) R309.1 R310.1 R326.2 TP9.TP
N$110: CF302.1 OP3.1(A:OUT) R305.2 R306.1
N$111: CF301.1 R303.2 R304.1
N$112: MX1.P$2(IF) R302.2 R303.1
N$113: MX1.P$3(RFP) RFIN1.1
N$114: MX0.P$3(RFP) RFIN0.1
N$116: ADC.2(CH0-) ADC.5(CH1-) CF311.1 R321.1
N$117: CB309.1 OP4.3(+IN) R322.1 R323.1
N$118: CF309.1 OP3.8(C:OUT) R319.1 R320.1 R327.2 TP6.TP
N$119: ADC.1(CH0+) CF310.1 R320.2
N$120: MX0.P$4(RFN) R311.2 RFIN0.2(GND1) RFIN0.3(GND2)
N$121: MX1.P$4(RFN) R301.2 RFIN1.2(GND1) RFIN1.3(GND2)
SCK_1: ADC.9(SCK) ; also sheet 1,2
VREF: ADC.3(VREF) CB302.1 CB303.1 CB304.1 R322.2 REF1.5(OUT_S) REF1.6(OUT_F)
VREF/2: OP4.1(OUT) OP4.4(-IN) R308.2 R318.2 R321.2 R324.2
VREF/4: CB310.1 OP3.3(A:+IN) OP3.12(D:+IN) R324.1 R325.1

## Sheet 4 of 4
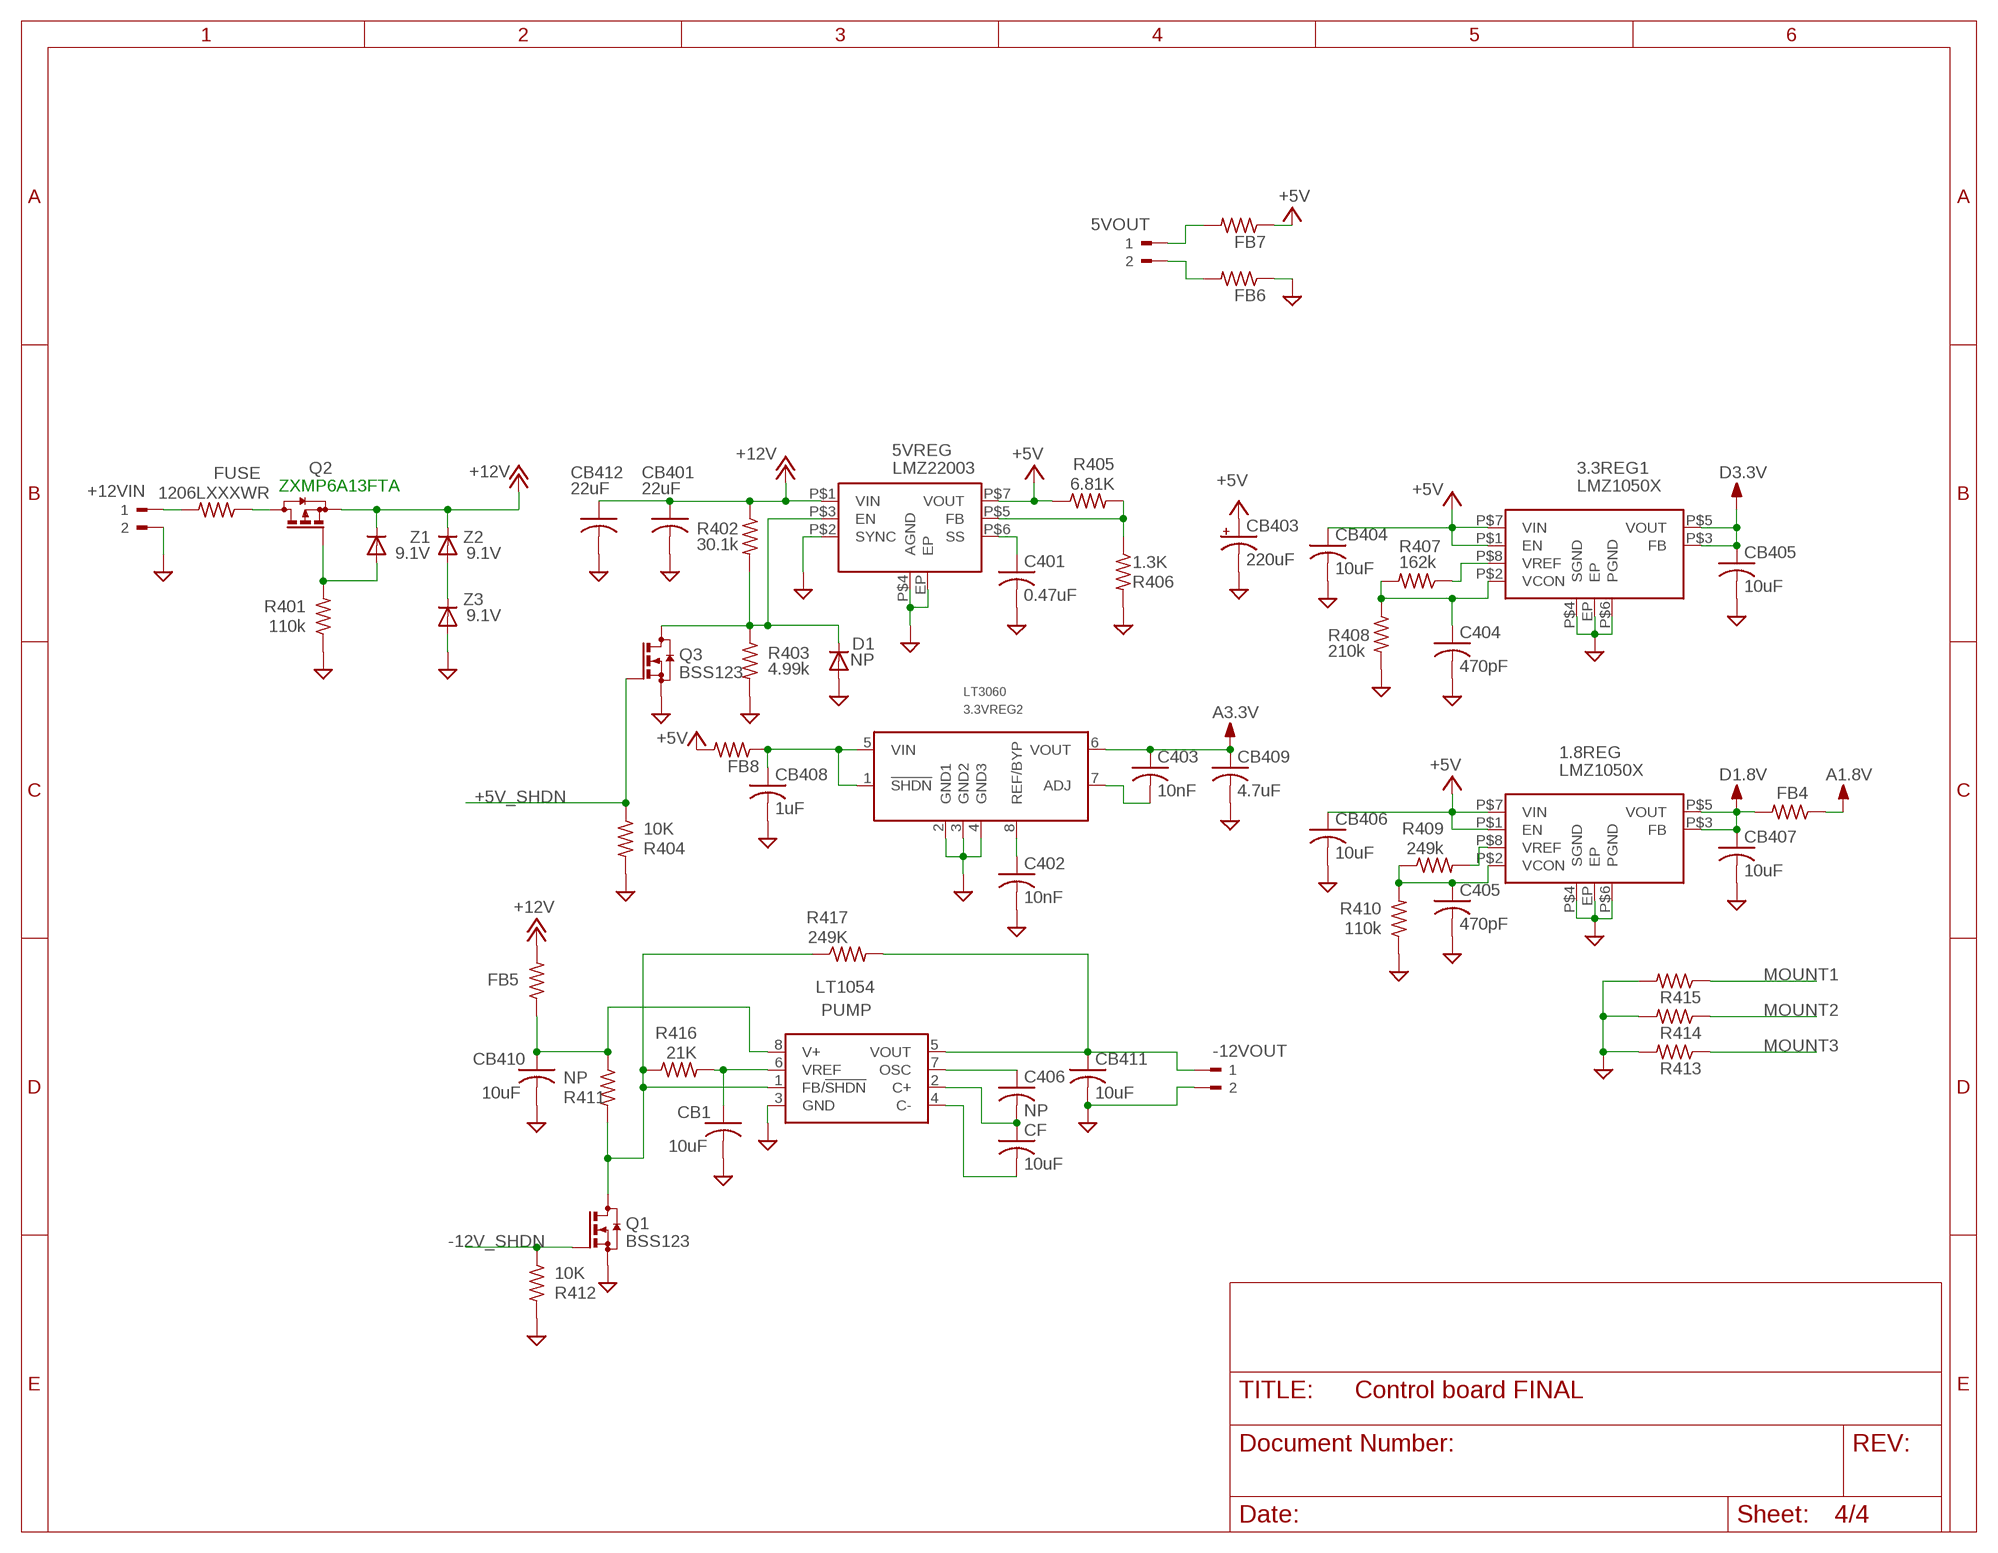
[diagram p3: schematic, sheet 4]

### Parts
1.8REG  LMZ1050X  [LLP-8]
3.3REG1  LMZ1050X  [LLP-8]
3.3VREG2  LT3060  [TSOT-8]
5VOUT  TERM-2OMNIMATE_SL  [OMNIMATE_SL_2POS]
5VREG  LMZ22003  [TO-PMOD7]
+12VIN  TERM-2OMNIMATE_SL  [OMNIMATE_SL_2POS]
-12VOUT  TERM-2OMNIMATE_SL  [OMNIMATE_SL_2POS]
C401  0.47uF  C-USC0805  [C0805]
C402  10nF  C-USC0603  [C0603]
C403  10nF  C-USC0603  [C0603]
C404  470pF  C-USC0603  [C0603]
C405  470pF  C-USC0603  [C0603]
C406  NP  C-USC0805  [C0805]
CB1  10uF  C-USC0805  [C0805]
CB401  22uF  C-USC1210  [C1210]
CB403  220uF  CPOL-USE3.5-8  [E3,5-8]
CB404  10uF  C-USC0805  [C0805]
CB405  10uF  C-USC0805  [C0805]
CB406  10uF  C-USC0805  [C0805]
CB407  10uF  C-USC0805  [C0805]
CB408  1uF  C-USC0805  [C0805]
CB409  4.7uF  C-USC0805  [C0805]
CB410  10uF  C-USC0805  [C0805]
CB411  10uF  C-USC0805  [C0805]
CB412  22uF  C-USC1210  [C1210]
CF  10uF  C-USC0805  [C0805]
D1  NP  DIODE-SOD323-W  [SOD323-W]
FB4  R-US_R0805  [R0805]
FB5  R-US_R0603  [R0603]
FB6  R-US_R0603  [R0603]
FB7  R-US_R0603  [R0603]
FB8  R-US_R0603  [R0603]
FUSE  1206LXXXWR  R-US_R1206  [R1206]
PUMP  LT1054  [SOIC-8]
Q1  BSS123  [SOT23]
Q2  ZXMP6A13FTA  BSS84  [SOT23]
Q3  BSS123  [SOT23]
R401  110k  R-US_R0805  [R0805]
R402  30.1k  R-US_R0805  [R0805]
R403  4.99k  R-US_R0805  [R0805]
R404  10K  R-US_R0805  [R0805]
R405  6.81K  R-US_R0805  [R0805]
R406  1.3K  R-US_R0805  [R0805]
R407  162k  R-US_R0805  [R0805]
R408  210k  R-US_R0805  [R0805]
R409  249k  R-US_R0805  [R0805]
R410  110k  R-US_R0805  [R0805]
R411  NP  R-US_R0805  [R0805]
R412  10K  R-US_R0805  [R0805]
R413  R-US_R0805  [R0805]
R414  R-US_R0805  [R0805]
R415  R-US_R0805  [R0805]
R416  21K  R-US_R0805  [R0805]
R417  249K  R-US_R0805  [R0805]
Z1  9.1V  DIODE-SOD123  [SOD123]
Z2  9.1V  DIODE-DO214AC  [DO214AC]
Z3  9.1V  DIODE-DO214AC  [DO214AC]

### Nets
+5V: 1.8REG.P$1(EN) 1.8REG.P$7(VIN) 3.3REG1.P$1(EN) 3.3REG1.P$7(VIN) 5VREG.P$7(VOUT) CB403.+ CB404.1 CB406.1 FB7.1 FB8.2 R405.1 ; also sheet 1,2
+5V_SHDN: Q3.1(G) R404.1 ; also sheet 1
+12V: 5VREG.P$1(VIN) CB401.1 CB412.1 FB5.2 Q2.2(S) R402.1 Z1.C Z2.C
-12V_SHDN: Q1.1(G) R412.1 ; also sheet 1
A1.8V: FB4.1 ; also sheet 2
A3.3V: 3.3VREG2.6(VOUT) C403.1 CB409.1 ; also sheet 3
D1.8V: 1.8REG.P$3(FB) 1.8REG.P$5(VOUT) CB407.1 FB4.2 ; also sheet 2
D3.3V: 3.3REG1.P$3(FB) 3.3REG1.P$5(VOUT) CB405.1 ; also sheet 1,2
GND: 1.8REG.EP 1.8REG.P$4(SGND) 1.8REG.P$6(PGND) 3.3REG1.EP 3.3REG1.P$4(SGND) 3.3REG1.P$6(PGND) 3.3VREG2.2(GND1) 3.3VREG2.3(GND2) 3.3VREG2.4(GND3) 5VREG.EP 5VREG.P$2(SYNC) 5VREG.P$4(AGND) +12VIN.2 -12VOUT.2 C401.2 C402.2 C404.2 C405.2 CB1.2 CB401.2 CB403.- CB404.2 CB405.2 CB406.2 CB407.2 CB408.2 CB409.2 CB410.2 CB411.2 CB412.2 D1.A FB6.1 PUMP.3(GND) Q1.2(S) Q3.2(S) R401.1 R403.2 R404.2 R406.2 R408.2 R410.1 R412.2 R413.2 R414.2 R415.2 Z3.A ; also sheet 1,2,3
MOUNT1: R415.1
MOUNT2: R414.1
MOUNT3: R413.1
N$2: 5VREG.P$6(SS) C401.1
N$7: 5VREG.P$3(EN) D1.C Q3.3(D) R402.2 R403.1
N$8: 5VOUT.1 FB7.2
N$9: 5VOUT.2 FB6.2
N$23: C406.1 PUMP.7(OSC)
N$25: C406.2 CF.1 PUMP.2(C+)
N$39: 5VREG.P$5(FB) R405.2 R406.1
N$40: CB410.1 FB5.1 PUMP.8(V+) R411.1
N$41: 3.3REG1.P$2(VCON) C404.1 R407.2 R408.1
N$42: 3.3REG1.P$8(VREF) R407.1
N$43: 1.8REG.P$8(VREF) R409.2
N$44: 1.8REG.P$2(VCON) C405.1 R409.1 R410.2
N$61: CB1.1 PUMP.6(VREF) R416.2
N$62: 3.3VREG2.8(REF/BYP) C402.1
N$63: 3.3VREG2.7(ADJ) C403.2
N$75: +12VIN.1 FUSE.2
N$77: Q2.1(G) R401.2 Z1.A
N$88: FUSE.1 Q2.3(D)
N$90: -12VOUT.1 CB411.1 PUMP.5(VOUT) R417.2
N$91: CF.2 PUMP.4(C-)
N$92: Z2.A Z3.C
N$93: 3.3VREG2.1(!SHDN) 3.3VREG2.5(VIN) CB408.1 FB8.1
N$94: PUMP.1(FB/!SHDN) Q1.3(D) R411.2 R416.1 R417.1

### Notes on the sheet
- ZXMP6A13FTA

## Library data of the parts
1.8REG 3.3REG1 = amyparts-rf:LMZ1050X
3.3VREG2 = amyparts-rf:LT3060
5VOUT +12VIN -12VOUT = amyparts-rf-combined:TERM-2
5VREG = amyparts-rf-combined:LMZ22003
ADC = amyparts-rf:LTC1407-1
C201-C204 C209-C220 C401-C406 CB1 CB101-CB126 CB201-CB216 CB301-CB310 CB401 CB404-CB412 CF CF301-CF311 CS1 = rcl:C-US: CAPACITOR, American symbol
C205-C208 = amyparts-rf-combined:CAPACITOR
CB403 = rcl:CPOL-US: POLARIZED CAPACITOR, American symbol
CH0/I CH1/Q LO0 LO1 RFIN0 RFIN1 TX0 TX1 = amyparts-rf:BNC-EDGE
CLK CS_DDS CS_SD DDSPDN DDSRESET GCLK0 GCLK1 MISO0 MOSI0 P0 P1-P3 SCK0 TP1-TP5 UPDATE = testpad:TPS: TEST PIN
D1 Z1-Z3 = diode:DIODE-: DIODE
DDS = amyparts-rf:AD9958
DREF = amyparts-rf-combined:REFERENCE-ADR50XX
FB1 FB2 FB4-FB8 FUSE R101-R120 R201-R228 R230-R233 R301-R327 R401-R417 = rcl:R-US_: RESISTOR, American symbol
FB3 = resistor:R-US_: RESISTOR, American symbol
FTDI = ftdichip-4:FT232RL: USB UART 4th Generation USB UART (USB <-> Serial) Controller
JP1 JP5 = pinhead:PINHD-1X4: PIN HEADER
JP3 = pinhead:PINHD-1X14: PIN HEADER
JTAG = atmel-avr32-michel:AVR-JTAG-10: AVR JTAG Debug/Programming Header
L_RX L_TX = led:LED: LED OSRAM: - CHIPLED LG R971, LG N971, LY N971, LG Q971, LY Q971, LO R971, LY R971 LH N974, LH R974 LS Q976, LO Q976, LY Q976 LO Q996 - Hyper CHIPLED LW Q18S LB Q993, LB Q99A, LB R99A - SideLED LS A670, LO A670, LY A670, LG A670, LP A670 LB A673, LV A673, LT A673, LW A673 LH A674 LY A675 LS A676, LA A676, LO A676, LY A676, LW A676 LS A679, LY A679, LG A679 - Hyper Micro SIDELED® LS Y876, LA Y876, LO Y876, LY Y876 LT Y87S - SmartLED LW L88C, LW L88S LB L89C, LB L89S, LG L890 LS L89K, LO L89K, LY L89K LS L896, LA L896, LO L896, LY L896 - TOPLED LS T670, LO T670, LY T670, LG T670, LP T670 LSG T670, LSP T670, LSY T670, LOP T670, LYG T670 LG T671, LOG T671, LSG T671 LB T673, LV T673, LT T673, LW T673 LH T674 LS T676, LA T676, LO T676, LY T676, LB T676, LH T676, LSB T676, LW T676 LB T67C, LV T67C, LT T67C, LS T67K, LO T67K, LY T67K, LW E67C LS E67B, LA E67B, LO E67B, LY E67B, LB E67C, LV E67C, LT E67C LW T67C LS T679, LY T679, LG T679 LS T770, LO T770, LY T770, LG T770, LP T770 LB T773, LV T773, LT T773, LW T773 LH T774 LS E675, LA E675, LY E675, LS T675 LS T776, LA T776, LO T776, LY T776, LB T776 LHGB T686 LT T68C, LB T68C - Hyper Mini TOPLED® LB M676 - Mini TOPLED Santana® LG M470 LS M47K, LO M47K, LY M47K Source: http://www.osram.convergy.de LUXEON: - LUMILED® LXK2-PW12-R00, LXK2-PW12-S00, LXK2-PW14-U00, LXK2-PW14-V00 LXK2-PM12-R00, LXK2-PM12-S00, LXK2-PM14-U00 LXK2-PE12-Q00, LXK2-PE12-R00, LXK2-PE12-S00, LXK2-PE14-T00, LXK2-PE14-U00 LXK2-PB12-K00, LXK2-PB12-L00, LXK2-PB12-M00, LXK2-PB14-N00, LXK2-PB14-P00, LXK2-PB14-Q00 LXK2-PR12-L00, LXK2-PR12-M00, LXK2-PR14-Q00, LXK2-PR14-R00 LXK2-PD12-Q00, LXK2-PD12-R00, LXK2-PD12-S00 LXK2-PH12-R00, LXK2-PH12-S00 LXK2-PL12-P00, LXK2-PL12-Q00, LXK2-PL12-R00 Source: www.luxeon.com KINGBRIGHT: KA-3528ASYC Source: www.kingbright.com
LCD = amyparts-rf-combined:PINHEAD-4
LF1 LF2 = amyparts-rf:INDUCTOR
MCU = atmel-avr32-michel:AT32UC3C1512/1256/1128: AT32UC3C1512/1256/1128
MX0 MX1 = amyparts-rf:ADE-1LH
OP1 OP2 = linear:2AMP_P8+4: OP AMP
OP3 = linear:4AMP_P4+11: OP AMP
OP4 = amyparts-rf:LMH6624
PUMP = amyparts-rf-combined:LT1054
Q1 Q3 = transistor-small-signal:BSS123: N-CHANNEL MOS FET
Q2 = transistor-small-signal:BSS84: P-CHANNEL MOS FET
REF1 = amyparts-rf:REF32XX
REFCLK = amyparts-rf:OSCILLATOR
RESET = amyparts-rf-2:TACT_SW
SD = amyparts-rf:DM3BT
SYNC = testpad:TP: Test pad
T1 T2 = amyparts-rf:BALUN_2:1
T3 = amyparts-rf-combined:BALUN_2:1
TP6 TP9 = testpad:TPSQ: Test pad
U$1-U$5 = amyparts-rf-combined:TESTPOINT
USB = con-hirose:MINI-USB-SHIELD-: MINI USB Connector Source: http://www.hirose.co.jp/cataloge_hp/e24000019.pdf; OC_FARNELL: unknown; OC_NEWARK: unknown

## Net classes
1 Highspeed digital: width 0.254 mm, drill 0.254 mm, clearance 0.203 mm
2 Lowspeed digital: width 0.254 mm, drill 0.254 mm, clearance 0.203 mm